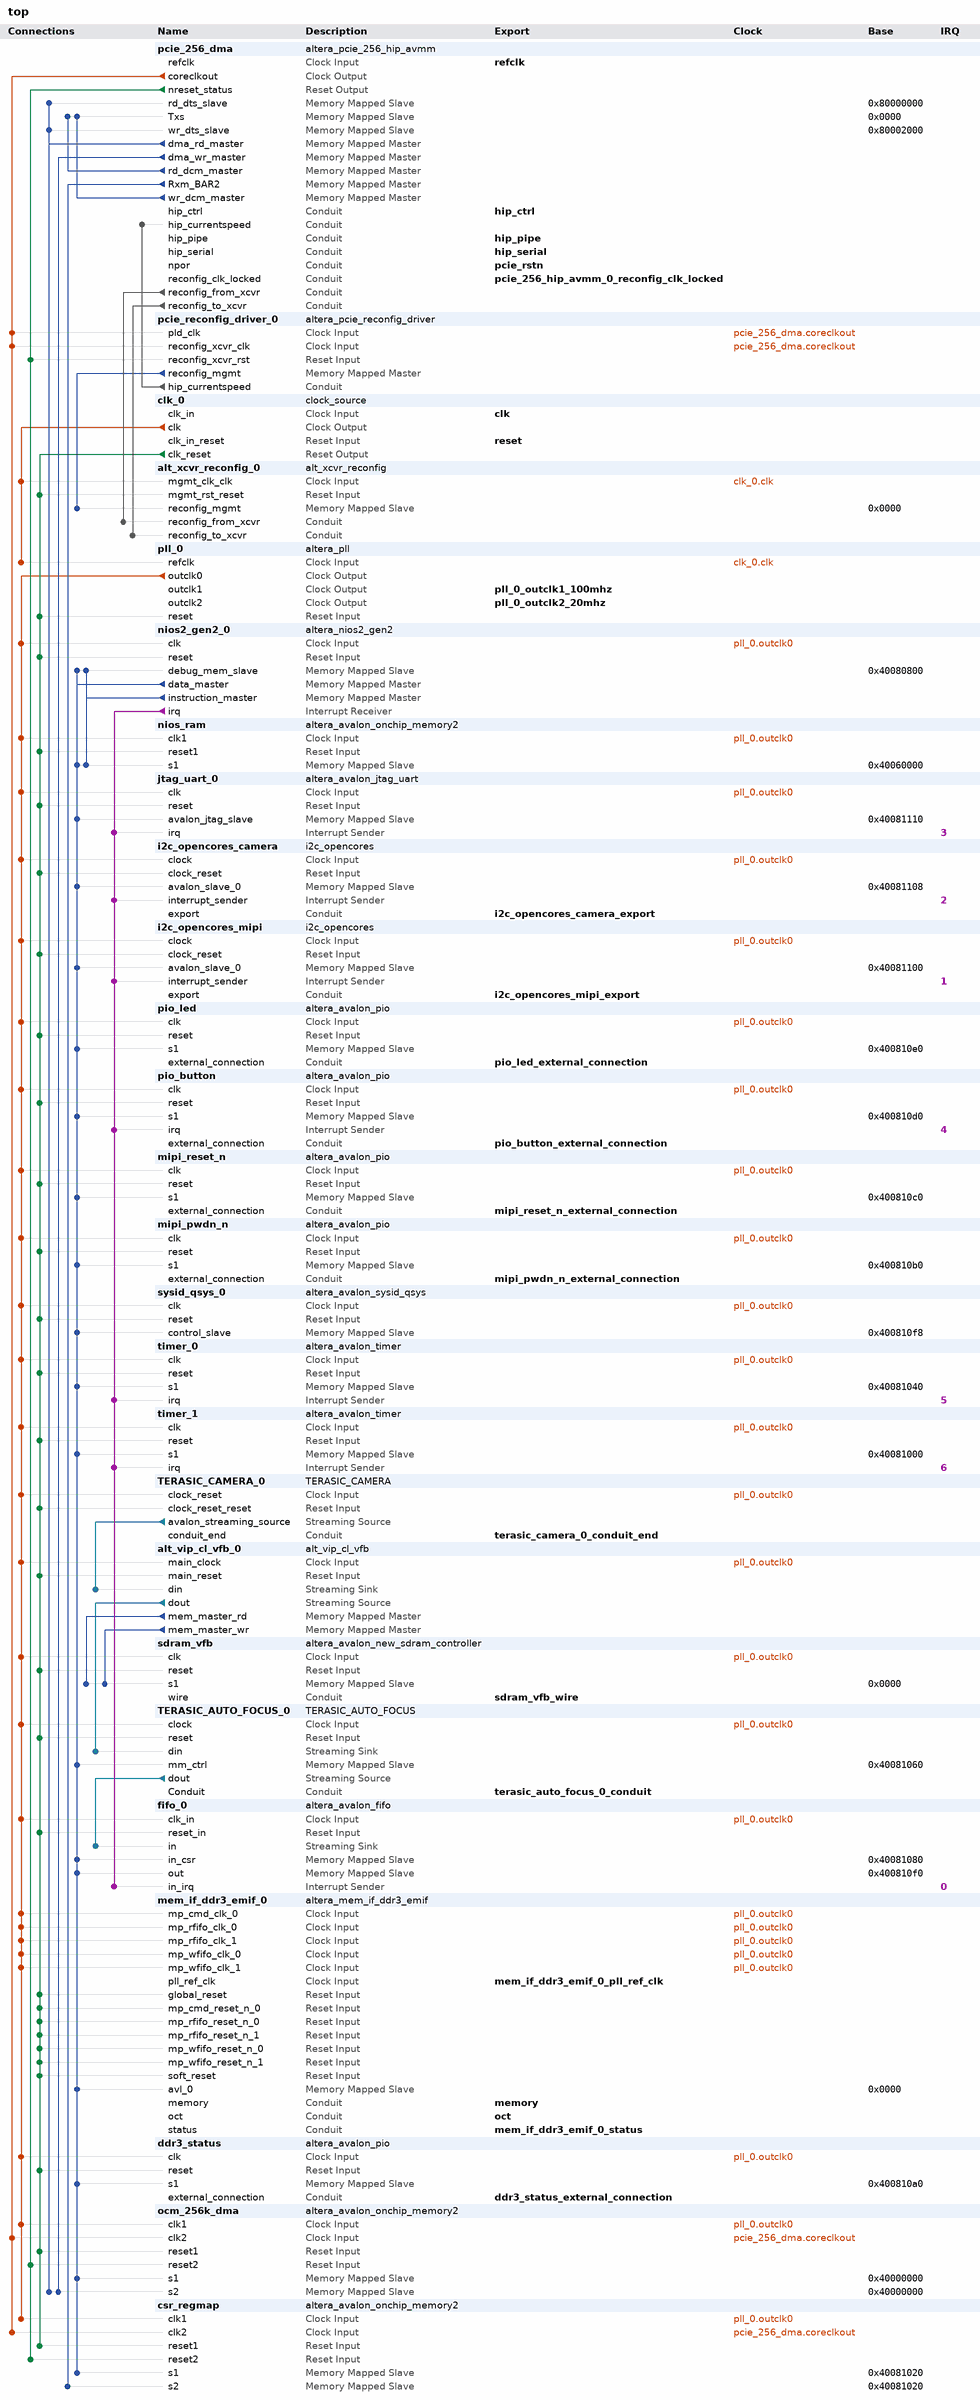
[diagram p0: system contents]
# Platform Designer (Qsys) system top, Cyclone V 5CGTFD9D5F27C7
# Parameters at their usual value, and those the tool derives, are not listed.
package require -exact qsys 18.1
create_system top
set_project_property DEVICE_FAMILY {Cyclone V}
set_project_property DEVICE 5CGTFD9D5F27C7

add_instance pcie_256_dma altera_pcie_256_hip_avmm 18.1
set_instance_parameter_value pcie_256_dma CB_P2A_AVALON_ADDR_B0 0x00000000
set_instance_parameter_value pcie_256_dma CB_P2A_AVALON_ADDR_B1 0x00000000
set_instance_parameter_value pcie_256_dma CB_P2A_AVALON_ADDR_B2 0x00000000
set_instance_parameter_value pcie_256_dma CB_P2A_AVALON_ADDR_B3 0x00000000
set_instance_parameter_value pcie_256_dma CB_P2A_AVALON_ADDR_B4 0x00000000
set_instance_parameter_value pcie_256_dma CB_P2A_AVALON_ADDR_B5 0x00000000
set_instance_parameter_value pcie_256_dma CB_P2A_FIXED_AVALON_ADDR_B0 0
set_instance_parameter_value pcie_256_dma CB_P2A_FIXED_AVALON_ADDR_B1 0
set_instance_parameter_value pcie_256_dma CB_P2A_FIXED_AVALON_ADDR_B2 0
set_instance_parameter_value pcie_256_dma CB_P2A_FIXED_AVALON_ADDR_B3 0
set_instance_parameter_value pcie_256_dma CB_P2A_FIXED_AVALON_ADDR_B4 0
set_instance_parameter_value pcie_256_dma CB_P2A_FIXED_AVALON_ADDR_B5 0
set_instance_parameter_value pcie_256_dma CG_COMMON_CLOCK_MODE 1
set_instance_parameter_value pcie_256_dma CG_RXM_IRQ_NUM 16
set_instance_parameter_value pcie_256_dma NUM_PREFETCH_MASTERS 1
set_instance_parameter_value pcie_256_dma RD_SLAVE_ADDRESS_MAP 32
set_instance_parameter_value pcie_256_dma SLAVE_ADDRESS_MAP_0 0
set_instance_parameter_value pcie_256_dma SLAVE_ADDRESS_MAP_1 0
set_instance_parameter_value pcie_256_dma SLAVE_ADDRESS_MAP_2 31
set_instance_parameter_value pcie_256_dma SLAVE_ADDRESS_MAP_3 0
set_instance_parameter_value pcie_256_dma SLAVE_ADDRESS_MAP_4 0
set_instance_parameter_value pcie_256_dma SLAVE_ADDRESS_MAP_5 0
set_instance_parameter_value pcie_256_dma TX_S_ADDR_WIDTH 64
set_instance_parameter_value pcie_256_dma WR_SLAVE_ADDRESS_MAP 31
set_instance_parameter_value pcie_256_dma add_pll_to_hip_coreclkout 0
set_instance_parameter_value pcie_256_dma advanced_default_hwtcl_atomic_malformed true
set_instance_parameter_value pcie_256_dma advanced_default_hwtcl_atomic_op_completer_32bit false
set_instance_parameter_value pcie_256_dma advanced_default_hwtcl_atomic_op_completer_64bit false
set_instance_parameter_value pcie_256_dma advanced_default_hwtcl_atomic_op_routing false
set_instance_parameter_value pcie_256_dma advanced_default_hwtcl_bridge_port_ssid_support false
set_instance_parameter_value pcie_256_dma advanced_default_hwtcl_bridge_port_vga_enable false
set_instance_parameter_value pcie_256_dma advanced_default_hwtcl_bypass_cdc false
set_instance_parameter_value pcie_256_dma advanced_default_hwtcl_cas_completer_128bit false
set_instance_parameter_value pcie_256_dma advanced_default_hwtcl_cdc_dummy_insert_limit 11
set_instance_parameter_value pcie_256_dma advanced_default_hwtcl_d0_pme false
set_instance_parameter_value pcie_256_dma advanced_default_hwtcl_d1_pme false
set_instance_parameter_value pcie_256_dma advanced_default_hwtcl_d1_support false
set_instance_parameter_value pcie_256_dma advanced_default_hwtcl_d2_pme false
set_instance_parameter_value pcie_256_dma advanced_default_hwtcl_d2_support false
set_instance_parameter_value pcie_256_dma advanced_default_hwtcl_d3_cold_pme false
set_instance_parameter_value pcie_256_dma advanced_default_hwtcl_d3_hot_pme false
set_instance_parameter_value pcie_256_dma advanced_default_hwtcl_data_pack_rx disable
set_instance_parameter_value pcie_256_dma advanced_default_hwtcl_deskew_comma com_deskw
set_instance_parameter_value pcie_256_dma advanced_default_hwtcl_device_number 0
set_instance_parameter_value pcie_256_dma advanced_default_hwtcl_disable_link_x2_support false
set_instance_parameter_value pcie_256_dma advanced_default_hwtcl_disable_snoop_packet false
set_instance_parameter_value pcie_256_dma advanced_default_hwtcl_ei_delay_powerdown_count 10
set_instance_parameter_value pcie_256_dma advanced_default_hwtcl_eie_before_nfts_count 4
set_instance_parameter_value pcie_256_dma advanced_default_hwtcl_enable_adapter_half_rate_mode false
set_instance_parameter_value pcie_256_dma advanced_default_hwtcl_enable_l1_aspm false
set_instance_parameter_value pcie_256_dma advanced_default_hwtcl_enable_rx_buffer_checking false
set_instance_parameter_value pcie_256_dma advanced_default_hwtcl_extended_format_field false
set_instance_parameter_value pcie_256_dma advanced_default_hwtcl_extended_tag_reset false
set_instance_parameter_value pcie_256_dma advanced_default_hwtcl_fc_init_timer 1024
set_instance_parameter_value pcie_256_dma advanced_default_hwtcl_flow_control_timeout_count 200
set_instance_parameter_value pcie_256_dma advanced_default_hwtcl_flow_control_update_count 30
set_instance_parameter_value pcie_256_dma advanced_default_hwtcl_flr_capability false
set_instance_parameter_value pcie_256_dma advanced_default_hwtcl_gen2_diffclock_nfts_count 255
set_instance_parameter_value pcie_256_dma advanced_default_hwtcl_gen2_sameclock_nfts_count 255
set_instance_parameter_value pcie_256_dma advanced_default_hwtcl_hot_plug_support 0
set_instance_parameter_value pcie_256_dma advanced_default_hwtcl_interrupt_pin inta
set_instance_parameter_value pcie_256_dma advanced_default_hwtcl_l01_entry_latency 31
set_instance_parameter_value pcie_256_dma advanced_default_hwtcl_l0_exit_latency_diffclock 6
set_instance_parameter_value pcie_256_dma advanced_default_hwtcl_l0_exit_latency_sameclock 6
set_instance_parameter_value pcie_256_dma advanced_default_hwtcl_l1_exit_latency_diffclock 0
set_instance_parameter_value pcie_256_dma advanced_default_hwtcl_l1_exit_latency_sameclock 0
set_instance_parameter_value pcie_256_dma advanced_default_hwtcl_low_priority_vc single_vc
set_instance_parameter_value pcie_256_dma advanced_default_hwtcl_ltr_mechanism false
set_instance_parameter_value pcie_256_dma advanced_default_hwtcl_ltssm_1ms_timeout disable
set_instance_parameter_value pcie_256_dma advanced_default_hwtcl_ltssm_freqlocked_check disable
set_instance_parameter_value pcie_256_dma advanced_default_hwtcl_maximum_current 0
set_instance_parameter_value pcie_256_dma advanced_default_hwtcl_no_command_completed true
set_instance_parameter_value pcie_256_dma advanced_default_hwtcl_no_soft_reset false
set_instance_parameter_value pcie_256_dma advanced_default_hwtcl_pclk_out_sel pclk
set_instance_parameter_value pcie_256_dma advanced_default_hwtcl_pipex1_debug_sel disable
set_instance_parameter_value pcie_256_dma advanced_default_hwtcl_register_pipe_signals false
set_instance_parameter_value pcie_256_dma advanced_default_hwtcl_reserved_debug 0
set_instance_parameter_value pcie_256_dma advanced_default_hwtcl_retry_buffer_last_active_address 2047
set_instance_parameter_value pcie_256_dma advanced_default_hwtcl_rx_l0s_count_idl 0
set_instance_parameter_value pcie_256_dma advanced_default_hwtcl_set_l0s 0
set_instance_parameter_value pcie_256_dma advanced_default_hwtcl_skp_os_gen3_count 0
set_instance_parameter_value pcie_256_dma advanced_default_hwtcl_skp_os_schedule_count 0
set_instance_parameter_value pcie_256_dma advanced_default_hwtcl_ssid 0
set_instance_parameter_value pcie_256_dma advanced_default_hwtcl_ssvid 0
set_instance_parameter_value pcie_256_dma advanced_default_hwtcl_tph_completer false
set_instance_parameter_value pcie_256_dma advanced_default_hwtcl_tx_cdc_almost_empty 5
set_instance_parameter_value pcie_256_dma advanced_default_hwtcl_vc0_clk_enable true
set_instance_parameter_value pcie_256_dma advanced_default_hwtcl_wrong_device_id disable
set_instance_parameter_value pcie_256_dma advanced_default_parameter_override 0
set_instance_parameter_value pcie_256_dma altpcie_avmm_hwtcl 1
set_instance_parameter_value pcie_256_dma app_interface_width_hwtcl 128
set_instance_parameter_value pcie_256_dma av_rpre_emph_a_val_hwtcl 12
set_instance_parameter_value pcie_256_dma av_rpre_emph_b_val_hwtcl 0
set_instance_parameter_value pcie_256_dma av_rpre_emph_c_val_hwtcl 19
set_instance_parameter_value pcie_256_dma av_rpre_emph_d_val_hwtcl 13
set_instance_parameter_value pcie_256_dma av_rpre_emph_e_val_hwtcl 21
set_instance_parameter_value pcie_256_dma av_rvod_sel_a_val_hwtcl 42
set_instance_parameter_value pcie_256_dma av_rvod_sel_b_val_hwtcl 30
set_instance_parameter_value pcie_256_dma av_rvod_sel_c_val_hwtcl 43
set_instance_parameter_value pcie_256_dma av_rvod_sel_d_val_hwtcl 43
set_instance_parameter_value pcie_256_dma av_rvod_sel_e_val_hwtcl 9
set_instance_parameter_value pcie_256_dma avmm_width_hwtcl 256
set_instance_parameter_value pcie_256_dma bar0_type_hwtcl 64
set_instance_parameter_value pcie_256_dma bar1_type_hwtcl 1
set_instance_parameter_value pcie_256_dma bar2_type_hwtcl 64
set_instance_parameter_value pcie_256_dma bar3_type_hwtcl 1
set_instance_parameter_value pcie_256_dma bar4_type_hwtcl 1
set_instance_parameter_value pcie_256_dma bar5_type_hwtcl 1
set_instance_parameter_value pcie_256_dma cdc_dummy_insert_limit_advanced_default_hwtcl 11
set_instance_parameter_value pcie_256_dma class_code_hwtcl 0
set_instance_parameter_value pcie_256_dma completion_timeout_hwtcl ABCD
set_instance_parameter_value pcie_256_dma cv_rpre_emph_a_val_hwtcl 11
set_instance_parameter_value pcie_256_dma cv_rpre_emph_b_val_hwtcl 0
set_instance_parameter_value pcie_256_dma cv_rpre_emph_c_val_hwtcl 22
set_instance_parameter_value pcie_256_dma cv_rpre_emph_d_val_hwtcl 12
set_instance_parameter_value pcie_256_dma cv_rpre_emph_e_val_hwtcl 21
set_instance_parameter_value pcie_256_dma cv_rvod_sel_a_val_hwtcl 50
set_instance_parameter_value pcie_256_dma cv_rvod_sel_b_val_hwtcl 34
set_instance_parameter_value pcie_256_dma cv_rvod_sel_c_val_hwtcl 50
set_instance_parameter_value pcie_256_dma cv_rvod_sel_d_val_hwtcl 50
set_instance_parameter_value pcie_256_dma cv_rvod_sel_e_val_hwtcl 9
set_instance_parameter_value pcie_256_dma d0_pme_advanced_default_hwtcl false
set_instance_parameter_value pcie_256_dma d1_pme_advanced_default_hwtcl false
set_instance_parameter_value pcie_256_dma d1_support_advanced_default_hwtcl false
set_instance_parameter_value pcie_256_dma d2_pme_advanced_default_hwtcl false
set_instance_parameter_value pcie_256_dma d2_support_advanced_default_hwtcl false
set_instance_parameter_value pcie_256_dma d3_cold_pme_advanced_default_hwtcl false
set_instance_parameter_value pcie_256_dma d3_hot_pme_advanced_default_hwtcl false
set_instance_parameter_value pcie_256_dma deemphasis_enable_advanced_default_hwtcl false
set_instance_parameter_value pcie_256_dma device_id_hwtcl 57347
set_instance_parameter_value pcie_256_dma device_number_advanced_default_hwtcl 0
set_instance_parameter_value pcie_256_dma diffclock_nfts_count_advanced_default_hwtcl 255
set_instance_parameter_value pcie_256_dma disable_link_x2_support_advanced_default_hwtcl false
set_instance_parameter_value pcie_256_dma dll_active_report_support_hwtcl 0
set_instance_parameter_value pcie_256_dma dma_use_scfifo_ext_hwtcl 0
set_instance_parameter_value pcie_256_dma ecrc_check_capable_hwtcl 0
set_instance_parameter_value pcie_256_dma ecrc_gen_capable_hwtcl 0
set_instance_parameter_value pcie_256_dma ei_delay_powerdown_count_advanced_default_hwtcl 10
set_instance_parameter_value pcie_256_dma eie_before_nfts_count_advanced_default_hwtcl 4
set_instance_parameter_value pcie_256_dma enable_completion_timeout_disable_hwtcl 1
set_instance_parameter_value pcie_256_dma enable_cra_hwtcl 0
set_instance_parameter_value pcie_256_dma enable_function_msix_support_hwtcl 0
set_instance_parameter_value pcie_256_dma enable_l1_aspm_advanced_default_hwtcl false
set_instance_parameter_value pcie_256_dma enable_pcisigtest_hwtcl 0
set_instance_parameter_value pcie_256_dma enable_power_on_rst_pulse_hwtcl 0
set_instance_parameter_value pcie_256_dma enable_rx_buffer_checking_advanced_default_hwtcl false
set_instance_parameter_value pcie_256_dma enable_rxm_burst_hwtcl 0
set_instance_parameter_value pcie_256_dma enable_slot_register_hwtcl 0
set_instance_parameter_value pcie_256_dma enable_tl_only_sim_hwtcl 0
set_instance_parameter_value pcie_256_dma endpoint_l0_latency_hwtcl 0
set_instance_parameter_value pcie_256_dma endpoint_l1_latency_hwtcl 0
set_instance_parameter_value pcie_256_dma expansion_base_address_register_hwtcl 0
set_instance_parameter_value pcie_256_dma extend_tag_field_hwtcl 32
set_instance_parameter_value pcie_256_dma fc_init_timer_advanced_default_hwtcl 1024
set_instance_parameter_value pcie_256_dma fixed_address_mode 0
set_instance_parameter_value pcie_256_dma flow_control_timeout_count_advanced_default_hwtcl 200
set_instance_parameter_value pcie_256_dma flow_control_update_count_advanced_default_hwtcl 30
set_instance_parameter_value pcie_256_dma force_hrc 0
set_instance_parameter_value pcie_256_dma force_src 0
set_instance_parameter_value pcie_256_dma gen123_lane_rate_mode_hwtcl {Gen2 (5.0 Gbps)}
set_instance_parameter_value pcie_256_dma gen2_diffclock_nfts_count_advanced_default_hwtcl 255
set_instance_parameter_value pcie_256_dma gen2_sameclock_nfts_count_advanced_default_hwtcl 255
set_instance_parameter_value pcie_256_dma gen3_rxfreqlock_counter_hwtcl 0
set_instance_parameter_value pcie_256_dma generate_sdc_for_qsys_design_example 0
set_instance_parameter_value pcie_256_dma hip_reconfig_hwtcl 0
set_instance_parameter_value pcie_256_dma hip_tag_checking_hwtcl 1
set_instance_parameter_value pcie_256_dma hot_plug_support_advanced_default_hwtcl 0
set_instance_parameter_value pcie_256_dma hwtcl_override_g2_txvod 1
set_instance_parameter_value pcie_256_dma in_cvp_mode_hwtcl 0
set_instance_parameter_value pcie_256_dma indicator_advanced_default_hwtcl 0
set_instance_parameter_value pcie_256_dma internal_controller_hwtcl 1
set_instance_parameter_value pcie_256_dma io_window_addr_width_hwtcl 0
set_instance_parameter_value pcie_256_dma l01_entry_latency_advanced_default_hwtcl 31
set_instance_parameter_value pcie_256_dma l0_exit_latency_diffclock_advanced_default_hwtcl 6
set_instance_parameter_value pcie_256_dma l0_exit_latency_sameclock_advanced_default_hwtcl 6
set_instance_parameter_value pcie_256_dma l1_exit_latency_diffclock_advanced_default_hwtcl 0
set_instance_parameter_value pcie_256_dma l1_exit_latency_sameclock_advanced_default_hwtcl 0
set_instance_parameter_value pcie_256_dma l2_async_logic_advanced_default_hwtcl disable
set_instance_parameter_value pcie_256_dma lane_mask_hwtcl x4
set_instance_parameter_value pcie_256_dma low_priority_vc_advanced_default_hwtcl single_vc
set_instance_parameter_value pcie_256_dma max_payload_size_hwtcl 256
set_instance_parameter_value pcie_256_dma msi_64bit_addressing_capable_hwtcl true
set_instance_parameter_value pcie_256_dma msi_masking_capable_hwtcl false
set_instance_parameter_value pcie_256_dma msi_multi_message_capable_hwtcl 1
set_instance_parameter_value pcie_256_dma msi_support_hwtcl true
set_instance_parameter_value pcie_256_dma msix_pba_bir_hwtcl 0
set_instance_parameter_value pcie_256_dma msix_pba_offset_hwtcl 0
set_instance_parameter_value pcie_256_dma msix_table_bir_hwtcl 0
set_instance_parameter_value pcie_256_dma msix_table_offset_hwtcl 0
set_instance_parameter_value pcie_256_dma msix_table_size_hwtcl 0
set_instance_parameter_value pcie_256_dma no_command_completed_advanced_default_hwtcl false
set_instance_parameter_value pcie_256_dma no_soft_reset_advanced_default_hwtcl false
set_instance_parameter_value pcie_256_dma override_rxbuffer_cred_preset 0
set_instance_parameter_value pcie_256_dma override_tbpartner_driver_setting_hwtcl 0
set_instance_parameter_value pcie_256_dma pcie_inspector_hwtcl 0
set_instance_parameter_value pcie_256_dma pcie_qsys 1
set_instance_parameter_value pcie_256_dma pclk_out_sel_advanced_default_hwtcl pclk
set_instance_parameter_value pcie_256_dma pipex1_debug_sel_advanced_default_hwtcl disable
set_instance_parameter_value pcie_256_dma pll_refclk_freq_hwtcl {100 MHz}
set_instance_parameter_value pcie_256_dma port_link_number_hwtcl 1
set_instance_parameter_value pcie_256_dma port_type_hwtcl {Native endpoint}
set_instance_parameter_value pcie_256_dma prefetchable_mem_window_addr_width_hwtcl 0
set_instance_parameter_value pcie_256_dma register_pipe_signals_advanced_default_hwtcl true
set_instance_parameter_value pcie_256_dma reserved_debug_advanced_default_hwtcl 0
set_instance_parameter_value pcie_256_dma retry_buffer_last_active_address_advanced_default_hwtcl 255
set_instance_parameter_value pcie_256_dma revision_id_hwtcl 1
set_instance_parameter_value pcie_256_dma rpre_emph_a_val_hwtcl 9
set_instance_parameter_value pcie_256_dma rpre_emph_b_val_hwtcl 0
set_instance_parameter_value pcie_256_dma rpre_emph_c_val_hwtcl 16
set_instance_parameter_value pcie_256_dma rpre_emph_d_val_hwtcl 13
set_instance_parameter_value pcie_256_dma rpre_emph_e_val_hwtcl 5
set_instance_parameter_value pcie_256_dma rvod_sel_a_val_hwtcl 42
set_instance_parameter_value pcie_256_dma rvod_sel_b_val_hwtcl 38
set_instance_parameter_value pcie_256_dma rvod_sel_c_val_hwtcl 38
set_instance_parameter_value pcie_256_dma rvod_sel_d_val_hwtcl 43
set_instance_parameter_value pcie_256_dma rvod_sel_e_val_hwtcl 15
set_instance_parameter_value pcie_256_dma rx_cdc_almost_full_advanced_default_hwtcl 12
set_instance_parameter_value pcie_256_dma rx_l0s_count_idl_advanced_default_hwtcl 0
set_instance_parameter_value pcie_256_dma rxbuffer_rxreq_hwtcl Low
set_instance_parameter_value pcie_256_dma sameclock_nfts_count_advanced_default_hwtcl 255
set_instance_parameter_value pcie_256_dma serial_sim_hwtcl 1
set_instance_parameter_value pcie_256_dma set_pld_clk_x1_625MHz_hwtcl 0
set_instance_parameter_value pcie_256_dma set_pll_coreclkout_slack 10
set_instance_parameter_value pcie_256_dma skp_os_schedule_count_advanced_default_hwtcl 0
set_instance_parameter_value pcie_256_dma slot_number_hwtcl 0
set_instance_parameter_value pcie_256_dma slot_power_limit_hwtcl 0
set_instance_parameter_value pcie_256_dma slot_power_scale_hwtcl 0
set_instance_parameter_value pcie_256_dma slotclkcfg_hwtcl 1
set_instance_parameter_value pcie_256_dma subsystem_device_id_hwtcl 13409
set_instance_parameter_value pcie_256_dma subsystem_vendor_id_hwtcl 4369
set_instance_parameter_value pcie_256_dma surprise_down_error_support_hwtcl 0
set_instance_parameter_value pcie_256_dma tlp_insp_trg_dw0_hwtcl 2049
set_instance_parameter_value pcie_256_dma tlp_insp_trg_dw1_hwtcl 0
set_instance_parameter_value pcie_256_dma tlp_insp_trg_dw2_hwtcl 0
set_instance_parameter_value pcie_256_dma tlp_insp_trg_dw3_hwtcl 0
set_instance_parameter_value pcie_256_dma tlp_inspector_hwtcl 0
set_instance_parameter_value pcie_256_dma tlp_inspector_use_signal_probe_hwtcl 0
set_instance_parameter_value pcie_256_dma tx_cdc_almost_empty_advanced_default_hwtcl 5
set_instance_parameter_value pcie_256_dma tx_cdc_almost_full_advanced_default_hwtcl 11
set_instance_parameter_value pcie_256_dma use_aer_hwtcl 0
set_instance_parameter_value pcie_256_dma use_ast_parity 0
set_instance_parameter_value pcie_256_dma use_atx_pll_hwtcl 0
set_instance_parameter_value pcie_256_dma use_crc_forwarding_hwtcl 0
set_instance_parameter_value pcie_256_dma use_cvp_update_core_pof_hwtcl 0
set_instance_parameter_value pcie_256_dma use_rx_st_be_hwtcl 0
set_instance_parameter_value pcie_256_dma use_tl_cfg_sync_advanced_default_hwtcl 1
set_instance_parameter_value pcie_256_dma vc0_clk_enable_advanced_default_hwtcl true
set_instance_parameter_value pcie_256_dma vendor_id_hwtcl 4466
set_instance_parameter_value pcie_256_dma vsec_id_hwtcl 40960
set_instance_parameter_value pcie_256_dma vsec_rev_hwtcl 0

add_instance pcie_reconfig_driver_0 altera_pcie_reconfig_driver 18.1
set_instance_parameter_value pcie_reconfig_driver_0 gen123_lane_rate_mode_hwtcl {Gen2 (5.0 Gbps)}
set_instance_parameter_value pcie_reconfig_driver_0 number_of_reconfig_interfaces 5

add_instance clk_0 clock_source 18.1
set_instance_parameter_value clk_0 clockFrequency 50000000

add_instance alt_xcvr_reconfig_0 alt_xcvr_reconfig 18.1
set_instance_parameter_value alt_xcvr_reconfig_0 device_family {Cyclone V}
set_instance_parameter_value alt_xcvr_reconfig_0 enable_adce 1
set_instance_parameter_value alt_xcvr_reconfig_0 enable_analog 1
set_instance_parameter_value alt_xcvr_reconfig_0 number_of_reconfig_interfaces 5

add_instance pll_0 altera_pll 18.1
set_instance_parameter_value pll_0 gui_device_speed_grade 1
set_instance_parameter_value pll_0 gui_number_of_clocks 3
set_instance_parameter_value pll_0 gui_operation_mode direct
set_instance_parameter_value pll_0 gui_output_clock_frequency0 125.0
set_instance_parameter_value pll_0 gui_output_clock_frequency1 100.0
set_instance_parameter_value pll_0 gui_output_clock_frequency2 20.0
set_instance_parameter_value pll_0 gui_pll_mode {Integer-N PLL}
set_instance_parameter_value pll_0 gui_reference_clock_frequency 50.0
set_instance_parameter_value pll_0 gui_use_locked false

add_instance nios2_gen2_0 altera_nios2_gen2 18.1
set_instance_parameter_value nios2_gen2_0 dcache_size 2048
set_instance_parameter_value nios2_gen2_0 exceptionSlave nios_ram.s1
set_instance_parameter_value nios2_gen2_0 icache_size 4096
set_instance_parameter_value nios2_gen2_0 impl Fast
set_instance_parameter_value nios2_gen2_0 resetSlave nios_ram.s1

add_instance nios_ram altera_avalon_onchip_memory2 18.1
set_instance_parameter_value nios_ram dataWidth 32
set_instance_parameter_value nios_ram dualPort false
set_instance_parameter_value nios_ram initMemContent false
set_instance_parameter_value nios_ram initializationFileName onchip_mem
set_instance_parameter_value nios_ram memorySize 131072

add_instance jtag_uart_0 altera_avalon_jtag_uart 18.1
set_instance_parameter_value jtag_uart_0 simInteractiveOptions NO_INTERACTIVE_WINDOWS

add_instance i2c_opencores_camera i2c_opencores 12.0

add_instance i2c_opencores_mipi i2c_opencores 12.0

add_instance pio_led altera_avalon_pio 18.1
set_instance_parameter_value pio_led direction Output
set_instance_parameter_value pio_led width 4

add_instance pio_button altera_avalon_pio 18.1
set_instance_parameter_value pio_button direction Input
set_instance_parameter_value pio_button generateIRQ true
set_instance_parameter_value pio_button width 4

add_instance mipi_reset_n altera_avalon_pio 18.1
set_instance_parameter_value mipi_reset_n direction Output
set_instance_parameter_value mipi_reset_n width 1

add_instance mipi_pwdn_n altera_avalon_pio 18.1
set_instance_parameter_value mipi_pwdn_n direction Output
set_instance_parameter_value mipi_pwdn_n width 1

add_instance sysid_qsys_0 altera_avalon_sysid_qsys 18.1
set_instance_parameter_value sysid_qsys_0 id 0

add_instance timer_0 altera_avalon_timer 18.1
set_instance_parameter_value timer_0 period 1
set_instance_parameter_value timer_0 periodUnits MSEC

add_instance timer_1 altera_avalon_timer 18.1
set_instance_parameter_value timer_1 alwaysRun true
set_instance_parameter_value timer_1 fixedPeriod true
set_instance_parameter_value timer_1 period 500
set_instance_parameter_value timer_1 periodUnits USEC
set_instance_parameter_value timer_1 snapshot false

add_instance TERASIC_CAMERA_0 TERASIC_CAMERA 1.0

add_instance alt_vip_cl_vfb_0 alt_vip_cl_vfb 18.1
set_instance_parameter_value alt_vip_cl_vfb_0 CLOCKS_ARE_SEPARATE 0
set_instance_parameter_value alt_vip_cl_vfb_0 DROP_FRAMES 1
set_instance_parameter_value alt_vip_cl_vfb_0 DROP_REPEAT_USER 0
set_instance_parameter_value alt_vip_cl_vfb_0 IS_FRAME_READER 0
set_instance_parameter_value alt_vip_cl_vfb_0 LINE_BASED_BUFFERING 0
set_instance_parameter_value alt_vip_cl_vfb_0 MAX_HEIGHT 480
set_instance_parameter_value alt_vip_cl_vfb_0 MAX_WIDTH 640
set_instance_parameter_value alt_vip_cl_vfb_0 MEM_BASE_ADDR 0
set_instance_parameter_value alt_vip_cl_vfb_0 MEM_BUFFER_OFFSET 16777216
set_instance_parameter_value alt_vip_cl_vfb_0 MEM_PORT_WIDTH 32
set_instance_parameter_value alt_vip_cl_vfb_0 PRIORITIZE_FMAX 0
set_instance_parameter_value alt_vip_cl_vfb_0 READER_RUNTIME_CONTROL 0
set_instance_parameter_value alt_vip_cl_vfb_0 READ_FIFO_DEPTH 512
set_instance_parameter_value alt_vip_cl_vfb_0 USER_PACKETS_MAX_STORAGE 1
set_instance_parameter_value alt_vip_cl_vfb_0 USE_BUFFER_OFFSET 0
set_instance_parameter_value alt_vip_cl_vfb_0 WRITE_BURST_TARGET 32
set_instance_parameter_value alt_vip_cl_vfb_0 WRITE_FIFO_DEPTH 512

add_instance sdram_vfb altera_avalon_new_sdram_controller 18.1
set_instance_parameter_value sdram_vfb TAC 5.5
set_instance_parameter_value sdram_vfb TRCD 20.0
set_instance_parameter_value sdram_vfb TRP 20.0
set_instance_parameter_value sdram_vfb casLatency 3
set_instance_parameter_value sdram_vfb columnWidth 10
set_instance_parameter_value sdram_vfb dataWidth 16
set_instance_parameter_value sdram_vfb generateSimulationModel false
set_instance_parameter_value sdram_vfb model single_Micron_MT48LC4M32B2_7_chip
set_instance_parameter_value sdram_vfb numberOfBanks 4
set_instance_parameter_value sdram_vfb numberOfChipSelects 1
set_instance_parameter_value sdram_vfb powerUpDelay 100.0
set_instance_parameter_value sdram_vfb refreshPeriod 15.625
set_instance_parameter_value sdram_vfb rowWidth 13

add_instance TERASIC_AUTO_FOCUS_0 TERASIC_AUTO_FOCUS 1.0

add_instance fifo_0 altera_avalon_fifo 18.1
set_instance_parameter_value fifo_0 bitsPerSymbol 8
set_instance_parameter_value fifo_0 channelWidth 8
set_instance_parameter_value fifo_0 errorWidth 8
set_instance_parameter_value fifo_0 fifoDepth 2048
set_instance_parameter_value fifo_0 fifoInputInterfaceOptions AVALONST_SINK
set_instance_parameter_value fifo_0 fifoOutputInterfaceOptions AVALONMM_READ
set_instance_parameter_value fifo_0 singleClockMode true
set_instance_parameter_value fifo_0 symbolsPerBeat 4
set_instance_parameter_value fifo_0 useIRQ true
set_instance_parameter_value fifo_0 usePacket true
set_instance_parameter_value fifo_0 useReadControl false

add_instance mem_if_ddr3_emif_0 altera_mem_if_ddr3_emif 18.1
set_instance_parameter_value mem_if_ddr3_emif_0 AVL_DATA_WIDTH_PORT 128,32,32,32,32,32
set_instance_parameter_value mem_if_ddr3_emif_0 AVL_MAX_SIZE 32
set_instance_parameter_value mem_if_ddr3_emif_0 CALIBRATION_MODE Full
set_instance_parameter_value mem_if_ddr3_emif_0 CPORT_TYPE_PORT Bidirectional,Bidirectional,Bidirectional,Bidirectional,Bidirectional,Bidirectional
set_instance_parameter_value mem_if_ddr3_emif_0 EXPORT_AFI_HALF_CLK false
set_instance_parameter_value mem_if_ddr3_emif_0 HARD_EMIF true
set_instance_parameter_value mem_if_ddr3_emif_0 MEM_BANKADDR_WIDTH 3
set_instance_parameter_value mem_if_ddr3_emif_0 MEM_CLK_FREQ 400.0
set_instance_parameter_value mem_if_ddr3_emif_0 MEM_CLK_FREQ_MAX 400.0
set_instance_parameter_value mem_if_ddr3_emif_0 MEM_COL_ADDR_WIDTH 10
set_instance_parameter_value mem_if_ddr3_emif_0 MEM_DQ_WIDTH 32
set_instance_parameter_value mem_if_ddr3_emif_0 MEM_FORMAT DISCRETE
set_instance_parameter_value mem_if_ddr3_emif_0 MEM_ROW_ADDR_WIDTH 15
set_instance_parameter_value mem_if_ddr3_emif_0 MEM_TCL 6
set_instance_parameter_value mem_if_ddr3_emif_0 MEM_TFAW_NS 50.0
set_instance_parameter_value mem_if_ddr3_emif_0 MEM_TRAS_NS 36.0
set_instance_parameter_value mem_if_ddr3_emif_0 MEM_TRCD_NS 13.125
set_instance_parameter_value mem_if_ddr3_emif_0 MEM_TRFC_NS 300.0
set_instance_parameter_value mem_if_ddr3_emif_0 MEM_TRP_NS 13.125
set_instance_parameter_value mem_if_ddr3_emif_0 MEM_TRRD_NS 10.0
set_instance_parameter_value mem_if_ddr3_emif_0 MEM_TRTP_NS 10.0
set_instance_parameter_value mem_if_ddr3_emif_0 MEM_TWTR 4
set_instance_parameter_value mem_if_ddr3_emif_0 MEM_VENDOR JEDEC
set_instance_parameter_value mem_if_ddr3_emif_0 MEM_WTCL 5
set_instance_parameter_value mem_if_ddr3_emif_0 PLL_LOCATION Top_Bottom
set_instance_parameter_value mem_if_ddr3_emif_0 POWER_OF_TWO_BUS true
set_instance_parameter_value mem_if_ddr3_emif_0 PRIORITY_PORT 1,1,1,1,1,1
set_instance_parameter_value mem_if_ddr3_emif_0 RATE Full
set_instance_parameter_value mem_if_ddr3_emif_0 REF_CLK_FREQ 50.0
set_instance_parameter_value mem_if_ddr3_emif_0 SPEED_GRADE 7
set_instance_parameter_value mem_if_ddr3_emif_0 TIMING_BOARD_AC_SKEW 0.017840331
set_instance_parameter_value mem_if_ddr3_emif_0 TIMING_BOARD_AC_TO_CK_SKEW -0.001076354
set_instance_parameter_value mem_if_ddr3_emif_0 TIMING_BOARD_DQ_TO_DQS_SKEW -0.003747657
set_instance_parameter_value mem_if_ddr3_emif_0 TIMING_BOARD_MAX_CK_DELAY 0.307845356
set_instance_parameter_value mem_if_ddr3_emif_0 TIMING_BOARD_MAX_DQS_DELAY 0.203650039
set_instance_parameter_value mem_if_ddr3_emif_0 TIMING_BOARD_SKEW_BETWEEN_DQS 0.055954396
set_instance_parameter_value mem_if_ddr3_emif_0 TIMING_BOARD_SKEW_CKDQS_DIMM_MAX 0.1595076
set_instance_parameter_value mem_if_ddr3_emif_0 TIMING_BOARD_SKEW_CKDQS_DIMM_MIN 0.1041954
set_instance_parameter_value mem_if_ddr3_emif_0 TIMING_BOARD_SKEW_WITHIN_DQS 0.015848394
set_instance_parameter_value mem_if_ddr3_emif_0 TIMING_TDH 150
set_instance_parameter_value mem_if_ddr3_emif_0 TIMING_TDQSCK 400
set_instance_parameter_value mem_if_ddr3_emif_0 TIMING_TDQSQ 200
set_instance_parameter_value mem_if_ddr3_emif_0 TIMING_TDQSS 0.25
set_instance_parameter_value mem_if_ddr3_emif_0 TIMING_TDS 75
set_instance_parameter_value mem_if_ddr3_emif_0 TIMING_TDSH 0.2
set_instance_parameter_value mem_if_ddr3_emif_0 TIMING_TDSS 0.2
set_instance_parameter_value mem_if_ddr3_emif_0 TIMING_TIH 275
set_instance_parameter_value mem_if_ddr3_emif_0 TIMING_TIS 200
set_instance_parameter_value mem_if_ddr3_emif_0 TIMING_TQSH 0.38
set_instance_parameter_value mem_if_ddr3_emif_0 USER_DEBUG_LEVEL 1

add_instance ddr3_status altera_avalon_pio 18.1
set_instance_parameter_value ddr3_status direction Input
set_instance_parameter_value ddr3_status width 3

add_instance ocm_256k_dma altera_avalon_onchip_memory2 18.1
set_instance_parameter_value ocm_256k_dma blockType M10K
set_instance_parameter_value ocm_256k_dma dataWidth 32
set_instance_parameter_value ocm_256k_dma dualPort true
set_instance_parameter_value ocm_256k_dma enableDiffWidth true
set_instance_parameter_value ocm_256k_dma initMemContent true
set_instance_parameter_value ocm_256k_dma initializationFileName onchip_mem.hex
set_instance_parameter_value ocm_256k_dma memorySize 262144

add_instance csr_regmap altera_avalon_onchip_memory2 18.1
set_instance_parameter_value csr_regmap dataWidth 32
set_instance_parameter_value csr_regmap dualPort true
set_instance_parameter_value csr_regmap initMemContent true
set_instance_parameter_value csr_regmap initializationFileName onchip_mem.hex
set_instance_parameter_value csr_regmap memorySize 32

# connections
add_connection clk_0.clk alt_xcvr_reconfig_0.mgmt_clk_clk clock
add_connection clk_0.clk pll_0.refclk clock
add_connection pcie_256_dma.coreclkout csr_regmap.clk2 clock
add_connection pcie_256_dma.coreclkout ocm_256k_dma.clk2 clock
add_connection pcie_256_dma.coreclkout pcie_reconfig_driver_0.pld_clk clock
add_connection pcie_256_dma.coreclkout pcie_reconfig_driver_0.reconfig_xcvr_clk clock
add_connection pll_0.outclk0 alt_vip_cl_vfb_0.main_clock clock
add_connection pll_0.outclk0 csr_regmap.clk1 clock
add_connection pll_0.outclk0 ddr3_status.clk clock
add_connection pll_0.outclk0 fifo_0.clk_in clock
add_connection pll_0.outclk0 i2c_opencores_camera.clock clock
add_connection pll_0.outclk0 i2c_opencores_mipi.clock clock
add_connection pll_0.outclk0 jtag_uart_0.clk clock
add_connection pll_0.outclk0 mem_if_ddr3_emif_0.mp_cmd_clk_0 clock
add_connection pll_0.outclk0 mem_if_ddr3_emif_0.mp_rfifo_clk_0 clock
add_connection pll_0.outclk0 mem_if_ddr3_emif_0.mp_rfifo_clk_1 clock
add_connection pll_0.outclk0 mem_if_ddr3_emif_0.mp_wfifo_clk_0 clock
add_connection pll_0.outclk0 mem_if_ddr3_emif_0.mp_wfifo_clk_1 clock
add_connection pll_0.outclk0 mipi_pwdn_n.clk clock
add_connection pll_0.outclk0 mipi_reset_n.clk clock
add_connection pll_0.outclk0 nios2_gen2_0.clk clock
add_connection pll_0.outclk0 nios_ram.clk1 clock
add_connection pll_0.outclk0 ocm_256k_dma.clk1 clock
add_connection pll_0.outclk0 pio_button.clk clock
add_connection pll_0.outclk0 pio_led.clk clock
add_connection pll_0.outclk0 sdram_vfb.clk clock
add_connection pll_0.outclk0 sysid_qsys_0.clk clock
add_connection pll_0.outclk0 TERASIC_AUTO_FOCUS_0.clock clock
add_connection pll_0.outclk0 TERASIC_CAMERA_0.clock_reset clock
add_connection pll_0.outclk0 timer_0.clk clock
add_connection pll_0.outclk0 timer_1.clk clock
add_connection clk_0.clk_reset alt_vip_cl_vfb_0.main_reset reset
add_connection clk_0.clk_reset alt_xcvr_reconfig_0.mgmt_rst_reset reset
add_connection clk_0.clk_reset csr_regmap.reset1 reset
add_connection clk_0.clk_reset ddr3_status.reset reset
add_connection clk_0.clk_reset fifo_0.reset_in reset
add_connection clk_0.clk_reset i2c_opencores_camera.clock_reset reset
add_connection clk_0.clk_reset i2c_opencores_mipi.clock_reset reset
add_connection clk_0.clk_reset jtag_uart_0.reset reset
add_connection clk_0.clk_reset mem_if_ddr3_emif_0.global_reset reset
add_connection clk_0.clk_reset mem_if_ddr3_emif_0.mp_cmd_reset_n_0 reset
add_connection clk_0.clk_reset mem_if_ddr3_emif_0.mp_rfifo_reset_n_0 reset
add_connection clk_0.clk_reset mem_if_ddr3_emif_0.mp_rfifo_reset_n_1 reset
add_connection clk_0.clk_reset mem_if_ddr3_emif_0.mp_wfifo_reset_n_0 reset
add_connection clk_0.clk_reset mem_if_ddr3_emif_0.mp_wfifo_reset_n_1 reset
add_connection clk_0.clk_reset mem_if_ddr3_emif_0.soft_reset reset
add_connection clk_0.clk_reset mipi_pwdn_n.reset reset
add_connection clk_0.clk_reset mipi_reset_n.reset reset
add_connection clk_0.clk_reset nios2_gen2_0.reset reset
add_connection clk_0.clk_reset nios_ram.reset1 reset
add_connection clk_0.clk_reset ocm_256k_dma.reset1 reset
add_connection clk_0.clk_reset pio_button.reset reset
add_connection clk_0.clk_reset pio_led.reset reset
add_connection clk_0.clk_reset pll_0.reset reset
add_connection clk_0.clk_reset sdram_vfb.reset reset
add_connection clk_0.clk_reset sysid_qsys_0.reset reset
add_connection clk_0.clk_reset TERASIC_AUTO_FOCUS_0.reset reset
add_connection clk_0.clk_reset TERASIC_CAMERA_0.clock_reset_reset reset
add_connection clk_0.clk_reset timer_0.reset reset
add_connection clk_0.clk_reset timer_1.reset reset
add_connection pcie_256_dma.nreset_status csr_regmap.reset2 reset
add_connection pcie_256_dma.nreset_status ocm_256k_dma.reset2 reset
add_connection pcie_256_dma.nreset_status pcie_reconfig_driver_0.reconfig_xcvr_rst reset
add_connection alt_vip_cl_vfb_0.mem_master_rd sdram_vfb.s1 avalon
set_connection_parameter_value alt_vip_cl_vfb_0.mem_master_rd/sdram_vfb.s1 baseAddress 0x0000
add_connection alt_vip_cl_vfb_0.mem_master_wr sdram_vfb.s1 avalon
set_connection_parameter_value alt_vip_cl_vfb_0.mem_master_wr/sdram_vfb.s1 baseAddress 0x0000
add_connection nios2_gen2_0.data_master csr_regmap.s1 avalon
set_connection_parameter_value nios2_gen2_0.data_master/csr_regmap.s1 baseAddress 0x40081020
add_connection nios2_gen2_0.data_master ddr3_status.s1 avalon
set_connection_parameter_value nios2_gen2_0.data_master/ddr3_status.s1 baseAddress 0x400810a0
add_connection nios2_gen2_0.data_master fifo_0.in_csr avalon
set_connection_parameter_value nios2_gen2_0.data_master/fifo_0.in_csr baseAddress 0x40081080
add_connection nios2_gen2_0.data_master fifo_0.out avalon
set_connection_parameter_value nios2_gen2_0.data_master/fifo_0.out baseAddress 0x400810f0
add_connection nios2_gen2_0.data_master i2c_opencores_camera.avalon_slave_0 avalon
set_connection_parameter_value nios2_gen2_0.data_master/i2c_opencores_camera.avalon_slave_0 baseAddress 0x40081108
add_connection nios2_gen2_0.data_master i2c_opencores_mipi.avalon_slave_0 avalon
set_connection_parameter_value nios2_gen2_0.data_master/i2c_opencores_mipi.avalon_slave_0 baseAddress 0x40081100
add_connection nios2_gen2_0.data_master jtag_uart_0.avalon_jtag_slave avalon
set_connection_parameter_value nios2_gen2_0.data_master/jtag_uart_0.avalon_jtag_slave baseAddress 0x40081110
add_connection nios2_gen2_0.data_master mem_if_ddr3_emif_0.avl_0 avalon
set_connection_parameter_value nios2_gen2_0.data_master/mem_if_ddr3_emif_0.avl_0 baseAddress 0x0000
add_connection nios2_gen2_0.data_master mipi_pwdn_n.s1 avalon
set_connection_parameter_value nios2_gen2_0.data_master/mipi_pwdn_n.s1 baseAddress 0x400810b0
add_connection nios2_gen2_0.data_master mipi_reset_n.s1 avalon
set_connection_parameter_value nios2_gen2_0.data_master/mipi_reset_n.s1 baseAddress 0x400810c0
add_connection nios2_gen2_0.data_master nios2_gen2_0.debug_mem_slave avalon
set_connection_parameter_value nios2_gen2_0.data_master/nios2_gen2_0.debug_mem_slave baseAddress 0x40080800
add_connection nios2_gen2_0.data_master nios_ram.s1 avalon
set_connection_parameter_value nios2_gen2_0.data_master/nios_ram.s1 baseAddress 0x40060000
add_connection nios2_gen2_0.data_master ocm_256k_dma.s1 avalon
set_connection_parameter_value nios2_gen2_0.data_master/ocm_256k_dma.s1 baseAddress 0x40000000
add_connection nios2_gen2_0.data_master pio_button.s1 avalon
set_connection_parameter_value nios2_gen2_0.data_master/pio_button.s1 baseAddress 0x400810d0
add_connection nios2_gen2_0.data_master pio_led.s1 avalon
set_connection_parameter_value nios2_gen2_0.data_master/pio_led.s1 baseAddress 0x400810e0
add_connection nios2_gen2_0.data_master sysid_qsys_0.control_slave avalon
set_connection_parameter_value nios2_gen2_0.data_master/sysid_qsys_0.control_slave baseAddress 0x400810f8
add_connection nios2_gen2_0.data_master TERASIC_AUTO_FOCUS_0.mm_ctrl avalon
set_connection_parameter_value nios2_gen2_0.data_master/TERASIC_AUTO_FOCUS_0.mm_ctrl baseAddress 0x40081060
add_connection nios2_gen2_0.data_master timer_0.s1 avalon
set_connection_parameter_value nios2_gen2_0.data_master/timer_0.s1 baseAddress 0x40081040
add_connection nios2_gen2_0.data_master timer_1.s1 avalon
set_connection_parameter_value nios2_gen2_0.data_master/timer_1.s1 baseAddress 0x40081000
add_connection nios2_gen2_0.instruction_master nios2_gen2_0.debug_mem_slave avalon
set_connection_parameter_value nios2_gen2_0.instruction_master/nios2_gen2_0.debug_mem_slave baseAddress 0x40080800
add_connection nios2_gen2_0.instruction_master nios_ram.s1 avalon
set_connection_parameter_value nios2_gen2_0.instruction_master/nios_ram.s1 baseAddress 0x40060000
add_connection pcie_256_dma.dma_rd_master ocm_256k_dma.s2 avalon
set_connection_parameter_value pcie_256_dma.dma_rd_master/ocm_256k_dma.s2 baseAddress 0x40000000
add_connection pcie_256_dma.dma_rd_master pcie_256_dma.rd_dts_slave avalon
set_connection_parameter_value pcie_256_dma.dma_rd_master/pcie_256_dma.rd_dts_slave baseAddress 0x80000000
add_connection pcie_256_dma.dma_rd_master pcie_256_dma.wr_dts_slave avalon
set_connection_parameter_value pcie_256_dma.dma_rd_master/pcie_256_dma.wr_dts_slave baseAddress 0x80002000
add_connection pcie_256_dma.dma_wr_master ocm_256k_dma.s2 avalon
set_connection_parameter_value pcie_256_dma.dma_wr_master/ocm_256k_dma.s2 baseAddress 0x40000000
add_connection pcie_256_dma.rd_dcm_master pcie_256_dma.Txs avalon
set_connection_parameter_value pcie_256_dma.rd_dcm_master/pcie_256_dma.Txs baseAddress 0x0000
add_connection pcie_256_dma.Rxm_BAR2 csr_regmap.s2 avalon
set_connection_parameter_value pcie_256_dma.Rxm_BAR2/csr_regmap.s2 baseAddress 0x40081020
add_connection pcie_256_dma.wr_dcm_master pcie_256_dma.Txs avalon
set_connection_parameter_value pcie_256_dma.wr_dcm_master/pcie_256_dma.Txs baseAddress 0x0000
add_connection pcie_reconfig_driver_0.reconfig_mgmt alt_xcvr_reconfig_0.reconfig_mgmt avalon
set_connection_parameter_value pcie_reconfig_driver_0.reconfig_mgmt/alt_xcvr_reconfig_0.reconfig_mgmt baseAddress 0x0000
add_connection alt_vip_cl_vfb_0.dout TERASIC_AUTO_FOCUS_0.din avalon_streaming
add_connection TERASIC_AUTO_FOCUS_0.dout fifo_0.in avalon_streaming
add_connection TERASIC_CAMERA_0.avalon_streaming_source alt_vip_cl_vfb_0.din avalon_streaming
add_connection pcie_256_dma.reconfig_from_xcvr alt_xcvr_reconfig_0.reconfig_from_xcvr conduit
add_connection pcie_256_dma.reconfig_to_xcvr alt_xcvr_reconfig_0.reconfig_to_xcvr conduit
add_connection pcie_reconfig_driver_0.hip_currentspeed pcie_256_dma.hip_currentspeed conduit
add_connection nios2_gen2_0.irq fifo_0.in_irq interrupt
set_connection_parameter_value nios2_gen2_0.irq/fifo_0.in_irq irqNumber 0
add_connection nios2_gen2_0.irq i2c_opencores_camera.interrupt_sender interrupt
set_connection_parameter_value nios2_gen2_0.irq/i2c_opencores_camera.interrupt_sender irqNumber 2
add_connection nios2_gen2_0.irq i2c_opencores_mipi.interrupt_sender interrupt
set_connection_parameter_value nios2_gen2_0.irq/i2c_opencores_mipi.interrupt_sender irqNumber 1
add_connection nios2_gen2_0.irq jtag_uart_0.irq interrupt
set_connection_parameter_value nios2_gen2_0.irq/jtag_uart_0.irq irqNumber 3
add_connection nios2_gen2_0.irq pio_button.irq interrupt
set_connection_parameter_value nios2_gen2_0.irq/pio_button.irq irqNumber 4
add_connection nios2_gen2_0.irq timer_0.irq interrupt
set_connection_parameter_value nios2_gen2_0.irq/timer_0.irq irqNumber 5
add_connection nios2_gen2_0.irq timer_1.irq interrupt
set_connection_parameter_value nios2_gen2_0.irq/timer_1.irq irqNumber 6

# exported interfaces
add_interface clk clock sink
set_interface_property clk EXPORT_OF clk_0.clk_in
add_interface ddr3_status_external_connection conduit end
set_interface_property ddr3_status_external_connection EXPORT_OF ddr3_status.external_connection
add_interface hip_ctrl conduit end
set_interface_property hip_ctrl EXPORT_OF pcie_256_dma.hip_ctrl
add_interface hip_pipe conduit end
set_interface_property hip_pipe EXPORT_OF pcie_256_dma.hip_pipe
add_interface hip_serial conduit end
set_interface_property hip_serial EXPORT_OF pcie_256_dma.hip_serial
add_interface i2c_opencores_camera_export conduit end
set_interface_property i2c_opencores_camera_export EXPORT_OF i2c_opencores_camera.export
add_interface i2c_opencores_mipi_export conduit end
set_interface_property i2c_opencores_mipi_export EXPORT_OF i2c_opencores_mipi.export
add_interface mem_if_ddr3_emif_0_pll_ref_clk clock sink
set_interface_property mem_if_ddr3_emif_0_pll_ref_clk EXPORT_OF mem_if_ddr3_emif_0.pll_ref_clk
add_interface mem_if_ddr3_emif_0_status conduit end
set_interface_property mem_if_ddr3_emif_0_status EXPORT_OF mem_if_ddr3_emif_0.status
add_interface memory conduit end
set_interface_property memory EXPORT_OF mem_if_ddr3_emif_0.memory
add_interface mipi_pwdn_n_external_connection conduit end
set_interface_property mipi_pwdn_n_external_connection EXPORT_OF mipi_pwdn_n.external_connection
add_interface mipi_reset_n_external_connection conduit end
set_interface_property mipi_reset_n_external_connection EXPORT_OF mipi_reset_n.external_connection
add_interface oct conduit end
set_interface_property oct EXPORT_OF mem_if_ddr3_emif_0.oct
add_interface pcie_256_hip_avmm_0_reconfig_clk_locked conduit end
set_interface_property pcie_256_hip_avmm_0_reconfig_clk_locked EXPORT_OF pcie_256_dma.reconfig_clk_locked
add_interface pcie_rstn conduit end
set_interface_property pcie_rstn EXPORT_OF pcie_256_dma.npor
add_interface pio_button_external_connection conduit end
set_interface_property pio_button_external_connection EXPORT_OF pio_button.external_connection
add_interface pio_led_external_connection conduit end
set_interface_property pio_led_external_connection EXPORT_OF pio_led.external_connection
add_interface pll_0_outclk1_100mhz clock source
set_interface_property pll_0_outclk1_100mhz EXPORT_OF pll_0.outclk1
add_interface pll_0_outclk2_20mhz clock source
set_interface_property pll_0_outclk2_20mhz EXPORT_OF pll_0.outclk2
add_interface refclk clock sink
set_interface_property refclk EXPORT_OF pcie_256_dma.refclk
add_interface reset reset sink
set_interface_property reset EXPORT_OF clk_0.clk_in_reset
add_interface sdram_vfb_wire conduit end
set_interface_property sdram_vfb_wire EXPORT_OF sdram_vfb.wire
add_interface terasic_auto_focus_0_conduit conduit end
set_interface_property terasic_auto_focus_0_conduit EXPORT_OF TERASIC_AUTO_FOCUS_0.Conduit
add_interface terasic_camera_0_conduit_end conduit end
set_interface_property terasic_camera_0_conduit_end EXPORT_OF TERASIC_CAMERA_0.conduit_end

set_interconnect_requirement {$system} qsys_mm.clockCrossingAdapter FIFO
set_interconnect_requirement {$system} qsys_mm.maxAdditionalLatency 4

save_system top.qsys
